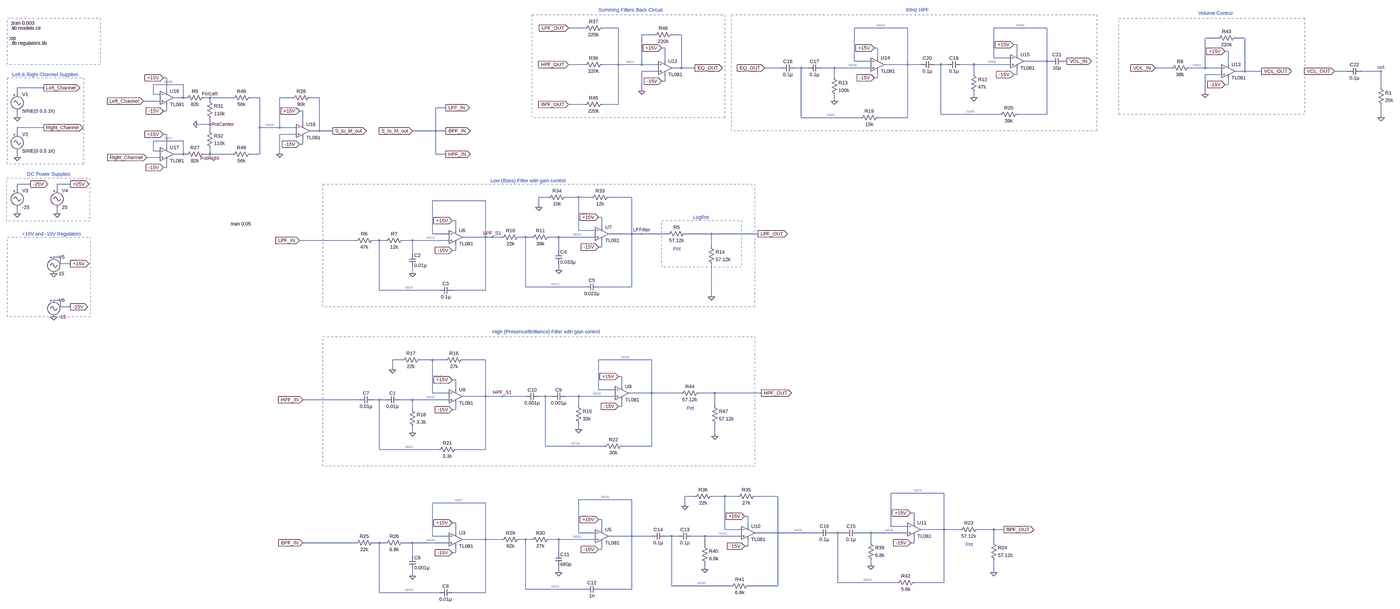
[diagram p0: schematic stereo_to_mono.asc, whole sheet]
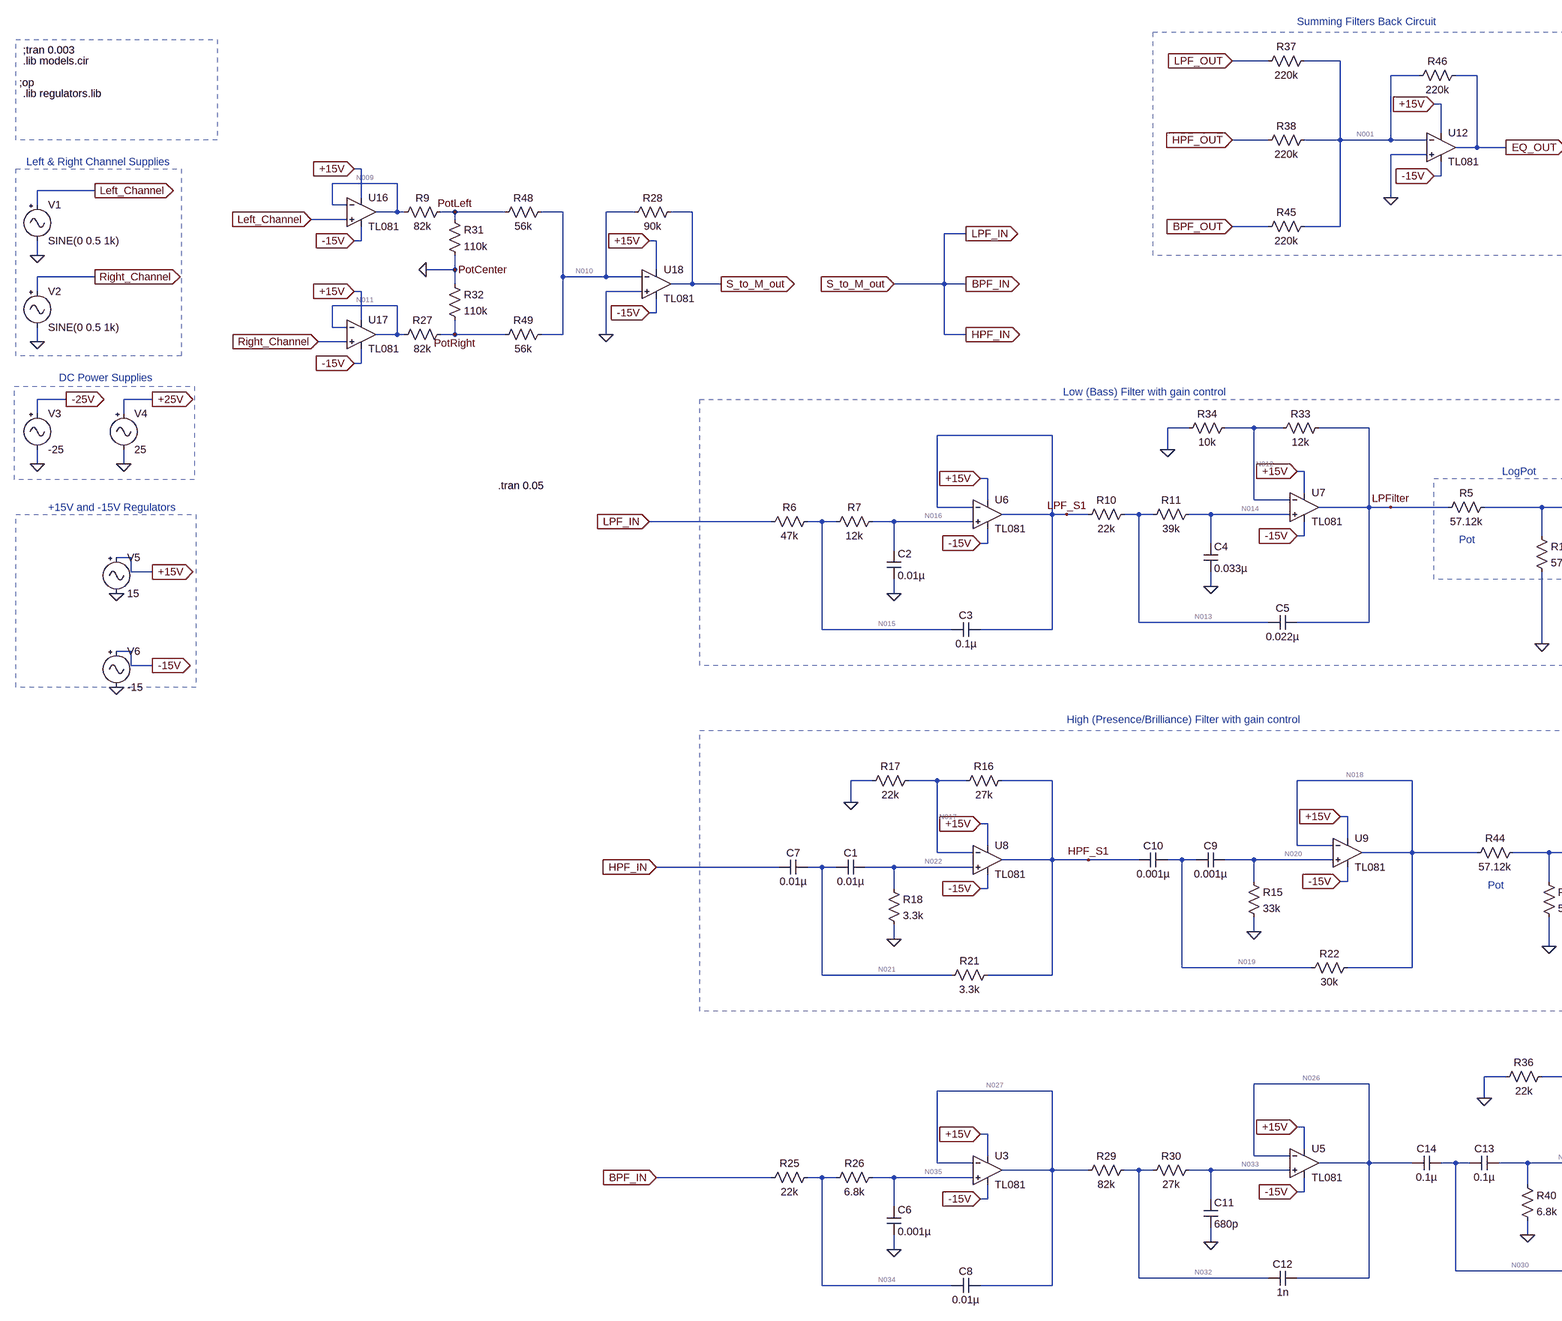
[diagram p1: schematic stereo_to_mono.asc, part, row 1 of 1, column 1 of 2]
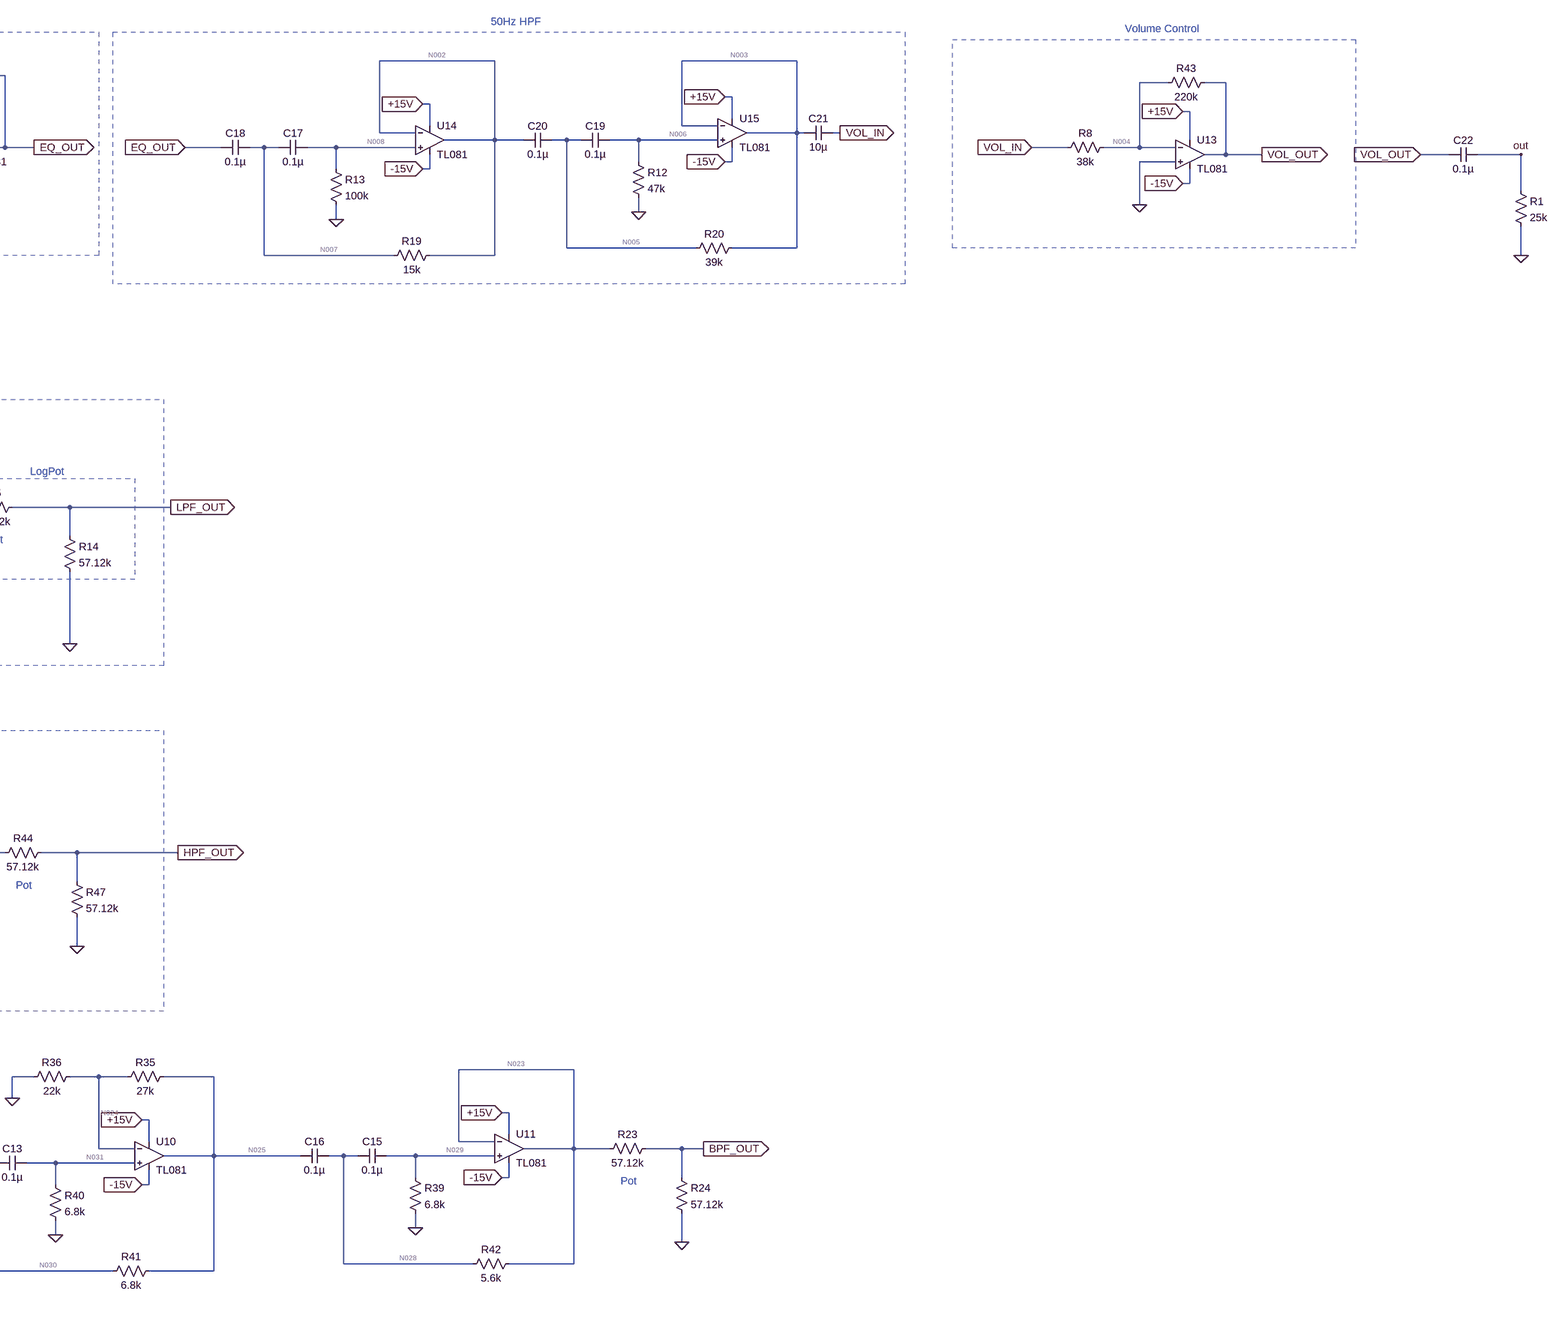
[diagram p2: schematic stereo_to_mono.asc, part, row 1 of 1, column 2 of 2]
stereo_to_mono.asc, the LTspice schematic file:
Version 4
SHEET 1 6500 2612
WIRE 2064 -208 1984 -208
WIRE 2224 -208 2144 -208
WIRE 3616 -208 3360 -208
WIRE 4288 -208 4032 -208
WIRE 2400 -176 2336 -176
WIRE 2528 -176 2480 -176
WIRE 5200 -160 5136 -160
WIRE 5328 -160 5280 -160
WIRE 4144 -128 4128 -128
WIRE 2448 -112 2432 -112
WIRE 3472 -112 3456 -112
WIRE 5248 -96 5232 -96
WIRE 4144 -80 4144 -128
WIRE 3472 -64 3472 -112
WIRE 4032 -64 4032 -208
WIRE 4112 -64 4032 -64
WIRE 2448 -48 2448 -112
WIRE 3360 -48 3360 -208
WIRE 3440 -48 3360 -48
WIRE 4288 -48 4288 -208
WIRE 4288 -48 4176 -48
WIRE 4304 -48 4288 -48
WIRE 4384 -48 4368 -48
WIRE 2064 -32 1984 -32
WIRE 2224 -32 2224 -208
WIRE 2224 -32 2144 -32
WIRE 2336 -32 2336 -176
WIRE 2336 -32 2224 -32
WIRE 2416 -32 2336 -32
WIRE 3616 -32 3616 -208
WIRE 3616 -32 3504 -32
WIRE 3680 -32 3616 -32
WIRE 3776 -32 3744 -32
WIRE 3808 -32 3776 -32
WIRE 3936 -32 3872 -32
WIRE 4112 -32 3936 -32
WIRE 5248 -32 5248 -96
WIRE 2528 -16 2528 -176
WIRE 2528 -16 2480 -16
WIRE 2592 -16 2528 -16
WIRE 3008 -16 2928 -16
WIRE 3104 -16 3072 -16
WIRE 3136 -16 3104 -16
WIRE 3264 -16 3200 -16
WIRE 3440 -16 3264 -16
WIRE 4976 -16 4896 -16
WIRE 5136 -16 5136 -160
WIRE 5136 -16 5056 -16
WIRE 5216 -16 5136 -16
WIRE 2416 0 2336 0
WIRE 5328 0 5328 -160
WIRE 5328 0 5280 0
WIRE 5408 0 5328 0
WIRE 5824 0 5760 0
WIRE 5984 0 5888 0
WIRE 3936 16 3936 -32
WIRE 4144 16 4144 -16
WIRE 4144 16 4128 16
WIRE 5216 16 5136 16
WIRE 48 32 32 32
WIRE 3264 32 3264 -16
WIRE 3472 32 3472 0
WIRE 3472 32 3456 32
WIRE 2448 48 2448 16
WIRE 2448 48 2432 48
WIRE 128 64 -16 64
WIRE 5248 64 5248 32
WIRE 5248 64 5232 64
WIRE -544 80 -672 80
WIRE 5984 80 5984 0
WIRE 48 96 48 32
WIRE 2336 96 2336 0
WIRE -672 112 -672 80
WIRE -16 112 -16 64
WIRE 16 112 -16 112
WIRE 5136 112 5136 16
WIRE 128 128 128 64
WIRE 128 128 80 128
WIRE 144 128 128 128
WIRE 256 128 224 128
WIRE 368 128 256 128
WIRE 496 128 448 128
WIRE 656 128 592 128
WIRE 784 128 736 128
WIRE 3936 128 3936 96
WIRE 16 144 -64 144
WIRE 256 144 256 128
WIRE 3264 144 3264 112
WIRE 2064 160 1984 160
WIRE 2224 160 2224 -32
WIRE 2224 160 2144 160
WIRE 1392 176 1344 176
WIRE 48 192 48 160
WIRE 48 192 32 192
WIRE 704 192 688 192
WIRE 3776 208 3776 -32
WIRE 4064 208 3776 208
WIRE 4288 208 4288 -48
WIRE 4288 208 4144 208
WIRE -672 224 -672 192
WIRE 3104 224 3104 -16
WIRE 3392 224 3104 224
WIRE 3616 224 3616 -32
WIRE 3616 224 3472 224
WIRE 5984 224 5984 160
WIRE 256 256 256 224
WIRE 256 256 192 256
WIRE 704 256 704 192
WIRE -544 272 -672 272
WIRE 496 272 496 128
WIRE 592 272 592 128
WIRE 592 272 496 272
WIRE 672 272 592 272
WIRE 256 288 256 256
WIRE 784 288 784 128
WIRE 784 288 736 288
WIRE 848 288 784 288
WIRE 1344 288 1344 176
WIRE 1344 288 1232 288
WIRE 1392 288 1344 288
WIRE -672 304 -672 272
WIRE 48 304 32 304
WIRE 672 304 592 304
WIRE 128 336 -16 336
WIRE 704 352 704 320
WIRE 704 352 688 352
WIRE 48 368 48 304
WIRE -16 384 -16 336
WIRE 16 384 -16 384
WIRE 128 400 128 336
WIRE 128 400 80 400
WIRE 144 400 128 400
WIRE 256 400 256 368
WIRE 256 400 224 400
WIRE 368 400 256 400
WIRE 496 400 496 272
WIRE 496 400 448 400
WIRE 592 400 592 304
WIRE 1344 400 1344 288
WIRE 1392 400 1344 400
WIRE -672 416 -672 384
WIRE 16 416 -48 416
WIRE 48 464 48 432
WIRE 48 464 32 464
WIRE -608 544 -672 544
WIRE -416 544 -480 544
WIRE -672 576 -672 544
WIRE -480 576 -480 544
WIRE 1888 608 1840 608
WIRE 2032 608 1968 608
WIRE 2096 608 2032 608
WIRE 2288 608 2176 608
WIRE 1584 624 1328 624
WIRE 1840 656 1840 608
WIRE -672 688 -672 656
WIRE -480 688 -480 656
WIRE 2144 704 2128 704
WIRE 1440 720 1424 720
WIRE 2144 752 2144 704
WIRE 1440 768 1440 720
WIRE 2032 768 2032 608
WIRE 2112 768 2032 768
WIRE 1328 784 1328 624
WIRE 1408 784 1328 784
WIRE 2288 784 2288 608
WIRE 2288 784 2176 784
WIRE 2336 784 2288 784
WIRE 2464 784 2336 784
WIRE 2672 784 2544 784
WIRE 2896 784 2672 784
WIRE 1584 800 1584 624
WIRE 1584 800 1472 800
WIRE 1616 800 1584 800
WIRE 1664 800 1616 800
WIRE 1776 800 1744 800
WIRE 1808 800 1776 800
WIRE 1936 800 1888 800
WIRE 2112 800 1936 800
WIRE 960 816 688 816
WIRE 1072 816 1040 816
WIRE 1104 816 1072 816
WIRE 1232 816 1184 816
WIRE 1408 816 1232 816
WIRE 2144 848 2144 816
WIRE 2144 848 2128 848
WIRE 2672 848 2672 784
WIRE 1440 864 1440 832
WIRE 1440 864 1424 864
WIRE 1936 864 1936 800
WIRE 1232 880 1232 816
WIRE -464 896 -496 896
WIRE -464 928 -464 896
WIRE -416 928 -464 928
WIRE 1936 960 1936 928
WIRE 1232 976 1232 944
WIRE 1776 1040 1776 800
WIRE 2064 1040 1776 1040
WIRE 2288 1040 2288 784
WIRE 2288 1040 2128 1040
WIRE 1072 1056 1072 816
WIRE 1360 1056 1072 1056
WIRE 1584 1056 1584 800
WIRE 1584 1056 1424 1056
WIRE 2672 1088 2672 928
WIRE -464 1104 -496 1104
WIRE -464 1136 -464 1104
WIRE -416 1136 -464 1136
WIRE 1184 1392 1136 1392
WIRE 1328 1392 1264 1392
WIRE 1392 1392 1328 1392
WIRE 1584 1392 1472 1392
WIRE 2384 1392 2128 1392
WIRE 1136 1440 1136 1392
WIRE 2240 1472 2224 1472
WIRE 1440 1488 1424 1488
WIRE 2240 1520 2240 1472
WIRE 1440 1536 1440 1488
WIRE 2128 1536 2128 1392
WIRE 2208 1536 2128 1536
WIRE 1328 1552 1328 1392
WIRE 1408 1552 1328 1552
WIRE 2384 1552 2384 1392
WIRE 2384 1552 2272 1552
WIRE 2528 1552 2384 1552
WIRE 2688 1552 2608 1552
WIRE 2912 1552 2688 1552
WIRE 1584 1568 1584 1392
WIRE 1584 1568 1472 1568
WIRE 1664 1568 1584 1568
WIRE 1776 1568 1664 1568
WIRE 1872 1568 1840 1568
WIRE 1904 1568 1872 1568
WIRE 2032 1568 1968 1568
WIRE 2208 1568 2032 1568
WIRE 976 1584 704 1584
WIRE 1072 1584 1040 1584
WIRE 1104 1584 1072 1584
WIRE 1232 1584 1168 1584
WIRE 1408 1584 1232 1584
WIRE 2032 1616 2032 1568
WIRE 2240 1616 2240 1584
WIRE 2240 1616 2224 1616
WIRE 2688 1616 2688 1552
WIRE 1232 1632 1232 1584
WIRE 1440 1632 1440 1600
WIRE 1440 1632 1424 1632
WIRE 2032 1728 2032 1696
WIRE 1232 1744 1232 1712
WIRE 2688 1760 2688 1696
WIRE 1872 1808 1872 1568
WIRE 2160 1808 1872 1808
WIRE 2384 1808 2384 1552
WIRE 2384 1808 2240 1808
WIRE 1072 1824 1072 1584
WIRE 1360 1824 1072 1824
WIRE 1584 1824 1584 1568
WIRE 1584 1824 1440 1824
WIRE 3792 2064 3536 2064
WIRE 2592 2080 2544 2080
WIRE 2736 2080 2672 2080
WIRE 2800 2080 2736 2080
WIRE 2992 2080 2880 2080
WIRE 2288 2096 2032 2096
WIRE 1584 2112 1328 2112
WIRE 2544 2128 2544 2080
WIRE 3648 2160 3632 2160
WIRE 2848 2176 2832 2176
WIRE 2144 2192 2128 2192
WIRE 1440 2208 1424 2208
WIRE 3648 2208 3648 2160
WIRE 2848 2224 2848 2176
WIRE 3536 2224 3536 2064
WIRE 3616 2224 3536 2224
WIRE 2144 2240 2144 2192
WIRE 2736 2240 2736 2080
WIRE 2816 2240 2736 2240
WIRE 3792 2240 3792 2064
WIRE 3792 2240 3680 2240
WIRE 3872 2240 3792 2240
WIRE 4032 2240 3952 2240
WIRE 4080 2240 4032 2240
WIRE 1440 2256 1440 2208
WIRE 2032 2256 2032 2096
WIRE 2112 2256 2032 2256
WIRE 2992 2256 2992 2080
WIRE 2992 2256 2880 2256
WIRE 3184 2256 2992 2256
WIRE 3280 2256 3248 2256
WIRE 3312 2256 3280 2256
WIRE 3440 2256 3376 2256
WIRE 3616 2256 3440 2256
WIRE 1328 2272 1328 2112
WIRE 1408 2272 1328 2272
WIRE 2288 2272 2288 2096
WIRE 2288 2272 2176 2272
WIRE 2384 2272 2288 2272
WIRE 2480 2272 2448 2272
WIRE 2512 2272 2480 2272
WIRE 2640 2272 2576 2272
WIRE 2816 2272 2640 2272
WIRE 1584 2288 1584 2112
WIRE 1584 2288 1472 2288
WIRE 1664 2288 1584 2288
WIRE 1776 2288 1744 2288
WIRE 1808 2288 1776 2288
WIRE 1936 2288 1888 2288
WIRE 2112 2288 1936 2288
WIRE 960 2304 704 2304
WIRE 1072 2304 1040 2304
WIRE 1104 2304 1072 2304
WIRE 1232 2304 1184 2304
WIRE 1408 2304 1232 2304
WIRE 3440 2304 3440 2256
WIRE 3648 2304 3648 2272
WIRE 3648 2304 3632 2304
WIRE 4032 2304 4032 2240
WIRE 2640 2320 2640 2272
WIRE 2848 2320 2848 2288
WIRE 2848 2320 2832 2320
WIRE 2144 2336 2144 2304
WIRE 2144 2336 2128 2336
WIRE 1440 2352 1440 2320
WIRE 1440 2352 1424 2352
WIRE 1936 2352 1936 2288
WIRE 1232 2368 1232 2304
WIRE 3440 2416 3440 2384
WIRE 2640 2432 2640 2400
WIRE 1936 2448 1936 2416
WIRE 4032 2448 4032 2384
WIRE 1232 2464 1232 2432
WIRE 3280 2496 3280 2256
WIRE 3568 2496 3280 2496
WIRE 3792 2496 3792 2240
WIRE 3792 2496 3648 2496
WIRE 2480 2512 2480 2272
WIRE 2768 2512 2480 2512
WIRE 2992 2512 2992 2256
WIRE 2992 2512 2848 2512
WIRE 1776 2528 1776 2288
WIRE 2064 2528 1776 2528
WIRE 2288 2528 2288 2272
WIRE 2288 2528 2128 2528
WIRE 1072 2544 1072 2304
WIRE 1360 2544 1072 2544
WIRE 1584 2544 1584 2288
WIRE 1584 2544 1424 2544
FLAG -544 80 Left_Channel
IOPIN -544 80 Out
FLAG -544 272 Right_Channel
IOPIN -544 272 Out
FLAG -672 224 0
FLAG -672 416 0
FLAG -672 688 0
FLAG -480 688 0
FLAG -608 544 -25V
IOPIN -608 544 Out
FLAG -416 544 +25V
IOPIN -416 544 Out
FLAG -416 928 +15V
IOPIN -416 928 Out
FLAG -416 1136 -15V
IOPIN -416 1136 Out
FLAG 1232 288 S_to_M_out
IOPIN 1232 288 In
FLAG 1392 176 LPF_IN
IOPIN 1392 176 Out
FLAG 1392 288 BPF_IN
IOPIN 1392 288 Out
FLAG 1392 400 HPF_IN
IOPIN 1392 400 Out
FLAG 1424 720 +15V
IOPIN 1424 720 In
FLAG 1424 864 -15V
IOPIN 1424 864 In
FLAG -496 976 0
FLAG -496 1184 0
FLAG 1232 976 0
FLAG 2896 784 LPF_OUT
IOPIN 2896 784 Out
FLAG 2128 704 +15V
IOPIN 2128 704 In
FLAG 2128 848 -15V
IOPIN 2128 848 In
FLAG 1936 960 0
FLAG 1616 800 LPF_S1
FLAG 688 816 LPF_IN
IOPIN 688 816 In
FLAG 2672 1088 0
FLAG 1424 1488 +15V
IOPIN 1424 1488 In
FLAG 1424 1632 -15V
IOPIN 1424 1632 In
FLAG 1232 1744 0
FLAG 1136 1440 0
FLAG 2224 1472 +15V
IOPIN 2224 1472 In
FLAG 2224 1616 -15V
IOPIN 2224 1616 In
FLAG 2032 1728 0
FLAG 704 1584 HPF_IN
IOPIN 704 1584 In
FLAG 1664 1568 HPF_S1
FLAG 2912 1552 HPF_OUT
IOPIN 2912 1552 Out
FLAG 1424 2208 +15V
IOPIN 1424 2208 In
FLAG 1424 2352 -15V
IOPIN 1424 2352 In
FLAG 1232 2464 0
FLAG 2128 2192 +15V
IOPIN 2128 2192 In
FLAG 2128 2336 -15V
IOPIN 2128 2336 In
FLAG 1936 2448 0
FLAG 2832 2176 +15V
IOPIN 2832 2176 In
FLAG 2832 2320 -15V
IOPIN 2832 2320 In
FLAG 2640 2432 0
FLAG 2544 2128 0
FLAG 3632 2160 +15V
IOPIN 3632 2160 In
FLAG 3632 2304 -15V
IOPIN 3632 2304 In
FLAG 3440 2416 0
FLAG 4080 2240 BPF_OUT
IOPIN 4080 2240 Out
FLAG 704 2304 BPF_IN
IOPIN 704 2304 In
FLAG 1840 656 0
FLAG 1984 -208 LPF_OUT
IOPIN 1984 -208 In
FLAG 1984 -32 HPF_OUT
IOPIN 1984 -32 In
FLAG 1984 160 BPF_OUT
IOPIN 1984 160 In
FLAG 2432 -112 +15V
IOPIN 2432 -112 In
FLAG 2432 48 -15V
IOPIN 2432 48 In
FLAG 2336 96 0
FLAG 2592 -16 EQ_OUT
IOPIN 2592 -16 Out
FLAG 2336 784 LPFilter
FLAG 2688 1760 0
FLAG 4032 2448 0
FLAG 5232 -96 +15V
IOPIN 5232 -96 In
FLAG 5232 64 -15V
IOPIN 5232 64 In
FLAG 5136 112 0
FLAG 2928 -16 EQ_OUT
IOPIN 2928 -16 In
FLAG 3456 -112 +15V
IOPIN 3456 -112 In
FLAG 3456 32 -15V
IOPIN 3456 32 In
FLAG 3264 144 0
FLAG 4128 -128 +15V
IOPIN 4128 -128 In
FLAG 4128 16 -15V
IOPIN 4128 16 In
FLAG 3936 128 0
FLAG 4384 -48 VOL_IN
IOPIN 4384 -48 Out
FLAG 4896 -16 VOL_IN
IOPIN 4896 -16 In
FLAG 5408 0 VOL_OUT
IOPIN 5408 0 Out
FLAG 32 464 -15V
IOPIN 32 464 In
FLAG 32 304 +15V
IOPIN 32 304 In
FLAG 32 32 +15V
IOPIN 32 32 In
FLAG 32 192 -15V
IOPIN 32 192 In
FLAG 848 288 S_to_M_out
IOPIN 848 288 Out
FLAG 688 192 +15V
IOPIN 688 192 In
FLAG 688 352 -15V
IOPIN 688 352 In
FLAG 592 400 0
FLAG 192 256 0
FLAG 256 128 PotLeft
FLAG 256 400 PotRight
FLAG 256 256 PotCenter
FLAG -64 144 Left_Channel
IOPIN -64 144 In
FLAG -48 416 Right_Channel
IOPIN -48 416 In
FLAG 5760 0 VOL_OUT
IOPIN 5760 0 In
FLAG 5984 224 0
FLAG 5984 0 out
SYMBOL Misc\\signal -672 96 R0
WINDOW 123 0 0 Left 0
WINDOW 39 0 0 Left 0
SYMATTR InstName V1
SYMATTR Value SINE(0 0.5 1k)
SYMBOL Misc\\signal -672 288 R0
WINDOW 123 0 0 Left 0
WINDOW 39 0 0 Left 0
SYMATTR InstName V2
SYMATTR Value SINE(0 0.5 1k)
SYMBOL Misc\\signal -672 560 R0
WINDOW 123 0 0 Left 0
WINDOW 39 0 0 Left 0
SYMATTR InstName V3
SYMATTR Value -25
SYMBOL Misc\\signal -480 560 R0
WINDOW 123 0 0 Left 0
WINDOW 39 0 0 Left 0
SYMATTR InstName V4
SYMATTR Value 25
SYMBOL OpAmps\\opamp2 1440 736 R0
SYMATTR InstName U6
SYMATTR Value TL081
SYMBOL res 1056 800 R90
WINDOW 0 0 56 VBottom 2
WINDOW 3 32 56 VTop 2
SYMATTR InstName R6
SYMATTR Value 47k
SYMBOL res 1200 800 R90
WINDOW 0 0 56 VBottom 2
WINDOW 3 32 56 VTop 2
SYMATTR InstName R7
SYMATTR Value 12k
SYMBOL cap 1216 880 R0
SYMATTR InstName C2
SYMATTR Value 0.01µ
SYMBOL cap 1424 1040 R90
WINDOW 0 0 32 VBottom 2
WINDOW 3 32 32 VTop 2
SYMATTR InstName C3
SYMATTR Value 0.1µ
SYMBOL Misc\\signal -496 880 R0
WINDOW 123 0 0 Left 0
WINDOW 39 0 0 Left 0
SYMATTR InstName V5
SYMATTR Value 15
SYMBOL Misc\\signal -496 1088 R0
WINDOW 123 0 0 Left 0
WINDOW 39 0 0 Left 0
SYMATTR InstName V6
SYMATTR Value -15
SYMBOL OpAmps\\opamp2 2144 720 R0
SYMATTR InstName U7
SYMATTR Value TL081
SYMBOL res 1760 784 R90
WINDOW 0 0 56 VBottom 2
WINDOW 3 32 56 VTop 2
SYMATTR InstName R10
SYMATTR Value 22k
SYMBOL res 1904 784 R90
WINDOW 0 0 56 VBottom 2
WINDOW 3 32 56 VTop 2
SYMATTR InstName R11
SYMATTR Value 39k
SYMBOL cap 1920 864 R0
SYMATTR InstName C4
SYMATTR Value 0.033µ
SYMBOL cap 2128 1024 R90
WINDOW 0 0 32 VBottom 2
WINDOW 3 32 32 VTop 2
SYMATTR InstName C5
SYMATTR Value 0.022µ
SYMBOL res 2448 800 R270
WINDOW 0 32 56 VTop 2
WINDOW 3 0 56 VBottom 2
SYMATTR InstName R5
SYMATTR Value 57.12k
SYMBOL res 2656 832 R0
SYMATTR InstName R14
SYMATTR Value 57.12k
SYMBOL OpAmps\\opamp2 1440 1504 R0
SYMATTR InstName U8
SYMATTR Value TL081
SYMBOL res 1488 1376 R90
WINDOW 0 0 56 VBottom 2
WINDOW 3 32 56 VTop 2
SYMATTR InstName R16
SYMATTR Value 27k
SYMBOL res 1280 1376 R90
WINDOW 0 0 56 VBottom 2
WINDOW 3 32 56 VTop 2
SYMATTR InstName R17
SYMATTR Value 22k
SYMBOL OpAmps\\opamp2 2240 1488 R0
SYMATTR InstName U9
SYMATTR Value TL081
SYMBOL cap 1168 1568 R90
WINDOW 0 0 32 VBottom 2
WINDOW 3 32 32 VTop 2
SYMATTR InstName C1
SYMATTR Value 0.01µ
SYMBOL cap 1040 1568 R90
WINDOW 0 0 32 VBottom 2
WINDOW 3 32 32 VTop 2
SYMATTR InstName C7
SYMATTR Value 0.01µ
SYMBOL cap 1968 1552 R90
WINDOW 0 0 32 VBottom 2
WINDOW 3 32 32 VTop 2
SYMATTR InstName C9
SYMATTR Value 0.001µ
SYMBOL cap 1840 1552 R90
WINDOW 0 0 32 VBottom 2
WINDOW 3 32 32 VTop 2
SYMATTR InstName C10
SYMATTR Value 0.001µ
SYMBOL res 2016 1600 R0
SYMATTR InstName R15
SYMATTR Value 33k
SYMBOL res 1216 1616 R0
SYMATTR InstName R18
SYMATTR Value 3.3k
SYMBOL res 1456 1808 R90
WINDOW 0 0 56 VBottom 2
WINDOW 3 32 56 VTop 2
SYMATTR InstName R21
SYMATTR Value 3.3k
SYMBOL res 2256 1792 R90
WINDOW 0 0 56 VBottom 2
WINDOW 3 32 56 VTop 2
SYMATTR InstName R22
SYMATTR Value 30k
SYMBOL OpAmps\\opamp2 1440 2224 R0
SYMATTR InstName U3
SYMATTR Value TL081
SYMBOL res 1056 2288 R90
WINDOW 0 0 56 VBottom 2
WINDOW 3 32 56 VTop 2
SYMATTR InstName R25
SYMATTR Value 22k
SYMBOL res 1200 2288 R90
WINDOW 0 0 56 VBottom 2
WINDOW 3 32 56 VTop 2
SYMATTR InstName R26
SYMATTR Value 6.8k
SYMBOL cap 1216 2368 R0
SYMATTR InstName C6
SYMATTR Value 0.001µ
SYMBOL cap 1424 2528 R90
WINDOW 0 0 32 VBottom 2
WINDOW 3 32 32 VTop 2
SYMATTR InstName C8
SYMATTR Value 0.01µ
SYMBOL OpAmps\\opamp2 2144 2208 R0
SYMATTR InstName U5
SYMATTR Value TL081
SYMBOL res 1760 2272 R90
WINDOW 0 0 56 VBottom 2
WINDOW 3 32 56 VTop 2
SYMATTR InstName R29
SYMATTR Value 82k
SYMBOL res 1904 2272 R90
WINDOW 0 0 56 VBottom 2
WINDOW 3 32 56 VTop 2
SYMATTR InstName R30
SYMATTR Value 27k
SYMBOL cap 1920 2352 R0
SYMATTR InstName C11
SYMATTR Value 680p
SYMBOL cap 2128 2512 R90
WINDOW 0 0 32 VBottom 2
WINDOW 3 32 32 VTop 2
SYMATTR InstName C12
SYMATTR Value 1n
SYMBOL OpAmps\\opamp2 2848 2192 R0
SYMATTR InstName U10
SYMATTR Value TL081
SYMBOL res 2896 2064 R90
WINDOW 0 0 56 VBottom 2
WINDOW 3 32 56 VTop 2
SYMATTR InstName R35
SYMATTR Value 27k
SYMBOL res 2688 2064 R90
WINDOW 0 0 56 VBottom 2
WINDOW 3 32 56 VTop 2
SYMATTR InstName R36
SYMATTR Value 22k
SYMBOL OpAmps\\opamp2 3648 2176 R0
SYMATTR InstName U11
SYMATTR Value TL081
SYMBOL cap 2576 2256 R90
WINDOW 0 0 32 VBottom 2
WINDOW 3 32 32 VTop 2
SYMATTR InstName C13
SYMATTR Value 0.1µ
SYMBOL cap 2448 2256 R90
WINDOW 0 0 32 VBottom 2
WINDOW 3 32 32 VTop 2
SYMATTR InstName C14
SYMATTR Value 0.1µ
SYMBOL cap 3376 2240 R90
WINDOW 0 0 32 VBottom 2
WINDOW 3 32 32 VTop 2
SYMATTR InstName C15
SYMATTR Value 0.1µ
SYMBOL cap 3248 2240 R90
WINDOW 0 0 32 VBottom 2
WINDOW 3 32 32 VTop 2
SYMATTR InstName C16
SYMATTR Value 0.1µ
SYMBOL res 3424 2288 R0
SYMATTR InstName R39
SYMATTR Value 6.8k
SYMBOL res 2624 2304 R0
SYMATTR InstName R40
SYMATTR Value 6.8k
SYMBOL res 2864 2496 R90
WINDOW 0 0 56 VBottom 2
WINDOW 3 32 56 VTop 2
SYMATTR InstName R41
SYMATTR Value 6.8k
SYMBOL res 3664 2480 R90
WINDOW 0 0 56 VBottom 2
WINDOW 3 32 56 VTop 2
SYMATTR InstName R42
SYMATTR Value 5.6k
SYMBOL res 2192 592 R90
WINDOW 0 0 56 VBottom 2
WINDOW 3 32 56 VTop 2
SYMATTR InstName R33
SYMATTR Value 12k
SYMBOL res 1984 592 R90
WINDOW 0 0 56 VBottom 2
WINDOW 3 32 56 VTop 2
SYMATTR InstName R34
SYMATTR Value 10k
SYMBOL res 2160 -224 R90
WINDOW 0 0 56 VBottom 2
WINDOW 3 32 56 VTop 2
SYMATTR InstName R37
SYMATTR Value 220k
SYMBOL res 2160 -48 R90
WINDOW 0 0 56 VBottom 2
WINDOW 3 32 56 VTop 2
SYMATTR InstName R38
SYMATTR Value 220k
SYMBOL res 2160 144 R90
WINDOW 0 0 56 VBottom 2
WINDOW 3 32 56 VTop 2
SYMATTR InstName R45
SYMATTR Value 220k
SYMBOL OpAmps\\opamp2 2448 -80 R0
SYMATTR InstName U12
SYMATTR Value TL081
SYMBOL res 2496 -192 R90
WINDOW 0 0 56 VBottom 2
WINDOW 3 32 56 VTop 2
SYMATTR InstName R46
SYMATTR Value 220k
SYMBOL res 2512 1568 R270
WINDOW 0 32 56 VTop 2
WINDOW 3 0 56 VBottom 2
SYMATTR InstName R44
SYMATTR Value 57.12k
SYMBOL res 2672 1600 R0
SYMATTR InstName R47
SYMATTR Value 57.12k
SYMBOL res 3856 2256 R270
WINDOW 0 32 56 VTop 2
WINDOW 3 0 56 VBottom 2
SYMATTR InstName R23
SYMATTR Value 57.12k
SYMBOL res 4016 2288 R0
SYMATTR InstName R24
SYMATTR Value 57.12k
SYMBOL OpAmps\\opamp2 5248 -64 R0
SYMATTR InstName U13
SYMATTR Value TL081
SYMBOL res 5296 -176 R90
WINDOW 0 0 56 VBottom 2
WINDOW 3 32 56 VTop 2
SYMATTR InstName R43
SYMATTR Value 220k
SYMBOL OpAmps\\opamp2 3472 -96 R0
SYMATTR InstName U14
SYMATTR Value TL081
SYMBOL OpAmps\\opamp2 4144 -112 R0
SYMATTR InstName U15
SYMATTR Value TL081
SYMBOL cap 3200 -32 R90
WINDOW 0 0 32 VBottom 2
WINDOW 3 32 32 VTop 2
SYMATTR InstName C17
SYMATTR Value 0.1µ
SYMBOL cap 3072 -32 R90
WINDOW 0 0 32 VBottom 2
WINDOW 3 32 32 VTop 2
SYMATTR InstName C18
SYMATTR Value 0.1µ
SYMBOL cap 3872 -48 R90
WINDOW 0 0 32 VBottom 2
WINDOW 3 32 32 VTop 2
SYMATTR InstName C19
SYMATTR Value 0.1µ
SYMBOL cap 3744 -48 R90
WINDOW 0 0 32 VBottom 2
WINDOW 3 32 32 VTop 2
SYMATTR InstName C20
SYMATTR Value 0.1µ
SYMBOL res 3920 0 R0
SYMATTR InstName R12
SYMATTR Value 47k
SYMBOL res 3248 16 R0
SYMATTR InstName R13
SYMATTR Value 100k
SYMBOL res 3488 208 R90
WINDOW 0 0 56 VBottom 2
WINDOW 3 32 56 VTop 2
SYMATTR InstName R19
SYMATTR Value 15k
SYMBOL res 4160 192 R90
WINDOW 0 0 56 VBottom 2
WINDOW 3 32 56 VTop 2
SYMATTR InstName R20
SYMATTR Value 39k
SYMBOL cap 4368 -64 R90
WINDOW 0 0 32 VBottom 2
WINDOW 3 32 32 VTop 2
SYMATTR InstName C21
SYMATTR Value 10µ
SYMBOL res 5072 -32 R90
WINDOW 0 0 56 VBottom 2
WINDOW 3 32 56 VTop 2
SYMATTR InstName R8
SYMATTR Value 38k
SYMBOL OpAmps\\opamp2 48 64 R0
SYMATTR InstName U16
SYMATTR Value TL081
SYMBOL OpAmps\\opamp2 48 336 R0
SYMATTR InstName U17
SYMATTR Value TL081
SYMBOL res 240 112 R90
WINDOW 0 0 56 VBottom 2
WINDOW 3 32 56 VTop 2
SYMATTR InstName R9
SYMATTR Value 82k
SYMBOL res 240 384 R90
WINDOW 0 0 56 VBottom 2
WINDOW 3 32 56 VTop 2
SYMATTR InstName R27
SYMATTR Value 82k
SYMBOL OpAmps\\opamp2 704 224 R0
SYMATTR InstName U18
SYMATTR Value TL081
SYMBOL res 752 112 R90
WINDOW 0 0 56 VBottom 2
WINDOW 3 32 56 VTop 2
SYMATTR InstName R28
SYMATTR Value 90k
SYMBOL res 240 128 R0
SYMATTR InstName R31
SYMATTR Value 110k
SYMBOL res 240 272 R0
SYMATTR InstName R32
SYMATTR Value 110k
SYMBOL res 464 112 R90
WINDOW 0 0 56 VBottom 2
WINDOW 3 32 56 VTop 2
SYMATTR InstName R48
SYMATTR Value 56k
SYMBOL res 464 384 R90
WINDOW 0 0 56 VBottom 2
WINDOW 3 32 56 VTop 2
SYMATTR InstName R49
SYMATTR Value 56k
SYMBOL cap 5888 -16 R90
WINDOW 0 0 32 VBottom 2
WINDOW 3 32 32 VTop 2
SYMATTR InstName C22
SYMATTR Value 0.1µ
SYMBOL res 5968 64 R0
SYMATTR InstName R1
SYMATTR Value 25k
TEXT -704 -208 Left 2 !.lib models.cir
TEXT -624 496 Left 2 ;DC Power Supplies
TEXT -712 -160 Left 2 !;op
TEXT -704 -232 Left 2 !;tran 0.003
TEXT -696 16 Left 2 ;Left & Right Channel Supplies
TEXT -704 -136 Left 2 !.lib regulators.lib
TEXT -648 784 Left 2 ;+15V and -15V Regulators
TEXT 352 736 Left 2 !.tran 0.05
TEXT 1608 528 Left 2 ;Low (Bass) Filter with gain control
TEXT 1616 1256 Left 2 ;High (Presence/Brilliance) Filter with gain control
TEXT 2488 856 Left 2 ;Pot
TEXT 2552 1624 Left 2 ;Pot
TEXT 3896 2312 Left 2 ;Pot
TEXT 2128 -296 Left 2 ;Summing Filters Back Circuit
TEXT 3608 -296 Left 2 ;50Hz HPF
TEXT 5104 -280 Left 2 ;Volume Control
TEXT 2584 704 Left 2 ;LogPot
RECTANGLE Normal -323 723 -723 515 2
RECTANGLE Normal -352 448 -720 32 2
RECTANGLE Normal -272 -32 -720 -256 2
RECTANGLE Normal -320 1184 -720 800 2
RECTANGLE Normal 2880 1136 800 544 2
RECTANGLE Normal 2880 1904 800 1280 2
RECTANGLE Normal 2736 224 1808 -272 2
RECTANGLE Normal 4528 288 2768 -272 2
RECTANGLE Normal 5616 208 4720 -256 2
RECTANGLE Normal 2816 944 2432 720 2

The netlist it stands for:
* stereo_to_mono.asc
V1 Left_Channel 0 SINE(0 0.5 1k)
V2 Right_Channel 0 SINE(0 0.5 1k)
V3 -25V 0 -25
V4 +25V 0 25
XU6 N016 LPF_S1 +15V -15V LPF_S1 TL081  ; pins In+ In- V+ V- OUT
R6 N015 HPF_IN 47k
R7 N016 N015 12k
C2 N016 0 0.01µ
C3 LPF_S1 N015 0.1µ
V5 +15V 0 15
V6 -15V 0 -15
XU7 N014 N012 +15V -15V LPFilter TL081  ; pins In+ In- V+ V- OUT
R10 N013 LPF_S1 22k
R11 N014 N013 39k
C4 N014 0 0.033µ
C5 LPFilter N013 0.022µ
R5 LPFilter LPF_OUT 57.12k
R14 LPF_OUT 0 57.12k
XU8 N022 N017 +15V -15V HPF_S1 TL081  ; pins In+ In- V+ V- OUT
R16 HPF_S1 N017 27k
R17 N017 0 22k
XU9 N020 N018 +15V -15V N018 TL081  ; pins In+ In- V+ V- OUT
C1 N022 N021 0.01µ
C7 N021 HPF_IN 0.01µ
C9 N020 N019 0.001µ
C10 N019 HPF_S1 0.001µ
R15 N020 0 33k
R18 N022 0 3.3k
R21 HPF_S1 N021 3.3k
R22 N018 N019 30k
XU3 N035 N027 +15V -15V N027 TL081  ; pins In+ In- V+ V- OUT
R25 N034 HPF_IN 22k
R26 N035 N034 6.8k
C6 N035 0 0.001µ
C8 N027 N034 0.01µ
XU5 N033 N026 +15V -15V N026 TL081  ; pins In+ In- V+ V- OUT
R29 N032 N027 82k
R30 N033 N032 27k
C11 N033 0 680p
C12 N026 N032 1n
XU10 N031 N024 +15V -15V N025 TL081  ; pins In+ In- V+ V- OUT
R35 N025 N024 27k
R36 N024 0 22k
XU11 N029 N023 +15V -15V N023 TL081  ; pins In+ In- V+ V- OUT
C13 N031 N030 0.1µ
C14 N030 N026 0.1µ
C15 N029 N028 0.1µ
C16 N028 N025 0.1µ
R39 N029 0 6.8k
R40 N031 0 6.8k
R41 N025 N030 6.8k
R42 N023 N028 5.6k
R33 LPFilter N012 12k
R34 N012 0 10k
R37 N001 LPF_OUT 220k
R38 N001 HPF_OUT 220k
R45 N001 BPF_OUT 220k
XU12 0 N001 +15V -15V EQ_OUT TL081  ; pins In+ In- V+ V- OUT
R46 EQ_OUT N001 220k
R44 N018 HPF_OUT 57.12k
R47 HPF_OUT 0 57.12k
R23 N023 BPF_OUT 57.12k
R24 BPF_OUT 0 57.12k
XU13 0 N004 +15V -15V VOL_OUT TL081  ; pins In+ In- V+ V- OUT
R43 VOL_OUT N004 220k
XU14 N008 N002 +15V -15V N002 TL081  ; pins In+ In- V+ V- OUT
XU15 N006 N003 +15V -15V N003 TL081  ; pins In+ In- V+ V- OUT
C17 N008 N007 0.1µ
C18 N007 EQ_OUT 0.1µ
C19 N006 N005 0.1µ
C20 N005 N002 0.1µ
R12 N006 0 47k
R13 N008 0 100k
R19 N002 N007 15k
R20 N003 N005 39k
C21 VOL_IN N003 10µ
R8 N004 VOL_IN 38k
XU16 Left_Channel N009 +15V -15V N009 TL081  ; pins In+ In- V+ V- OUT
XU17 Right_Channel N011 +15V -15V N011 TL081  ; pins In+ In- V+ V- OUT
R9 PotLeft N009 82k
R27 PotRight N011 82k
XU18 0 N010 +15V -15V HPF_IN TL081  ; pins In+ In- V+ V- OUT
R28 HPF_IN N010 90k
R31 PotLeft 0 110k
R32 0 PotRight 110k
R48 N010 PotLeft 56k
R49 N010 PotRight 56k
C22 out VOL_OUT 0.1µ
R1 out 0 25k
.lib models.cir
* DC Power Supplies
;op
;tran 0.003
* Left & Right Channel Supplies
.lib regulators.lib
* +15V and -15V Regulators
.tran 0.05
* Low (Bass) Filter with gain control
* High (Presence/Brilliance) Filter with gain control
* Pot
* Pot
* Pot
* Summing Filters Back Circuit
* 50Hz HPF
* Volume Control
* LogPot
.backanno
.end

* Results of the author's LTspice run, read from the files saved beside the schematic
* Operating Point, zero values left out:
*   V(-25v) = -25 V
*   V(+25v) = 25 V
*   V(lpf_s1) = 31.53 µV
*   V(-15v) = -15 V
*   V(+15v) = 15 V
*   V(n016) = 20.56 µV
*   V(n015) = 21.1 µV
*   V(hpf_in) = 23.21 µV
*   V(lpfilter) = 87.99 µV
*   V(n012) = 39.75 µV
*   V(n014) = 28.78 µV
*   V(n013) = 30.54 µV
*   V(lpf_out) = 40.2 µV
*   V(hpf_s1) = 25.32 µV
*   V(n017) = 10.82 µV
*   V(n022) = -148.7 nV
*   V(n018) = 9.484 µV
*   V(n020) = -1.487 µV
*   V(n021) = 25.32 µV
*   V(n019) = 9.484 µV
*   V(n027) = 32.89 µV
*   V(n035) = 21.92 µV
*   V(n034) = 22.22 µV
*   V(n026) = 38.95 µV
*   V(n033) = 27.98 µV
*   V(n032) = 29.19 µV
*   V(n025) = 24.97 µV
*   V(n024) = 10.66 µV
*   V(n031) = -306.4 nV
*   V(n023) = 10.66 µV
*   V(n029) = -306.4 nV
*   V(n030) = 24.97 µV
*   V(n028) = 10.66 µV
*   V(n001) = 10.97 µV
*   V(hpf_out) = 5.458 µV
*   V(bpf_out) = 5.98 µV
*   V(eq_out) = 2.158 µV
*   V(vol_out) = 20.88 µV
*   V(n004) = 10.97 µV
*   V(n002) = 6.465 µV
*   V(n008) = -4.505 µV
*   V(n003) = 8.853 µV
*   V(n006) = -2.117 µV
*   V(n007) = 6.465 µV
*   V(n005) = 8.853 µV
*   V(vol_in) = 10.97 µV
*   V(n009) = 10.97 µV
*   V(n011) = 10.97 µV
*   V(potleft) = 8.423 µV
*   V(potright) = 8.423 µV
*   V(n010) = 10.97 µV
*   I(R49) = 45.5 pA
*   I(R48) = 45.5 pA
*   I(R32) = -76.57 pA
*   I(R31) = 76.57 pA
*   I(R28) = 136 pA
*   I(R27) = -31.07 pA
*   I(R9) = -31.07 pA
*   I(R13) = -45.05 pA
*   I(R12) = -45.05 pA
*   I(R43) = 45.05 pA
*   I(R24) = 104.7 pA
*   I(R23) = 82.01 pA
*   I(R47) = 95.55 pA
*   I(R44) = 70.49 pA
*   I(R46) = -40.06 pA
*   I(R45) = 22.68 pA
*   I(R38) = 25.06 pA
*   I(R37) = -132.9 pA
*   I(R34) = 3.975 nA
*   I(R33) = 4.02 nA
*   I(R40) = -45.05 pA
*   I(R39) = -45.05 pA
*   I(R36) = 484.7 pA
*   I(R35) = 529.8 pA
*   I(R30) = -45.05 pA
*   I(R29) = -45.05 pA
*   I(R26) = -45.05 pA
*   I(R25) = -45.05 pA
*   I(R18) = -45.05 pA
*   I(R15) = -45.05 pA
*   I(R17) = 491.9 pA
*   I(R16) = 537 pA
*   I(R14) = 703.8 pA
*   I(R5) = 836.6 pA
*   I(R11) = -45.05 pA
*   I(R10) = -45.05 pA
*   I(R7) = -45.05 pA
*   I(R6) = -45.05 pA
*   I(V6) = 212.9 mA
*   I(V5) = -212.9 mA
*   I(V2) = -45.05 pA
*   I(V1) = -45.05 pA
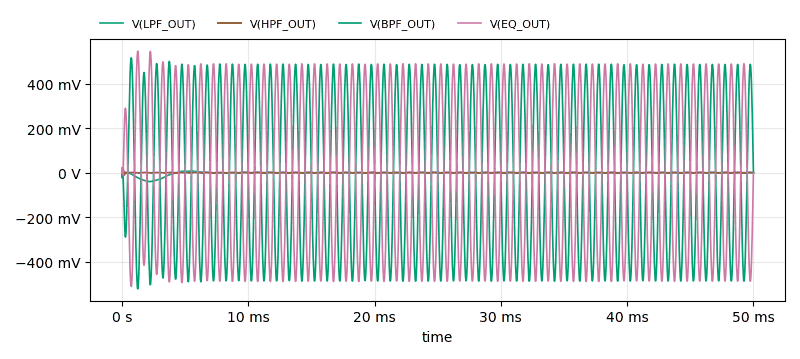
[diagram p3: Transient Analysis of stereo_to_mono.asc, plotted from the saved traces]
* Transient Analysis, 1 run:
*   V(LPF_OUT): min -40.19 mV, max 6.778 mV, average -1.514 mV, rms 7.254 mV, last -565.9 µV
*   V(HPF_OUT): min -23.11 mV, max 22.43 mV, average 7.299 µV, rms 1.098 mV, last 446.8 µV
*   V(BPF_OUT): min -522.2 mV, max 516.2 mV, average 1.508 mV, rms 342.4 mV, last 1.156 mV
*   V(EQ_OUT): min -510.9 mV, max 545.6 mV, average 52.34 µV, rms 343.5 mV, last -1.555 mV